# EAGLE design Inverter (EAGLE 7.3.0)
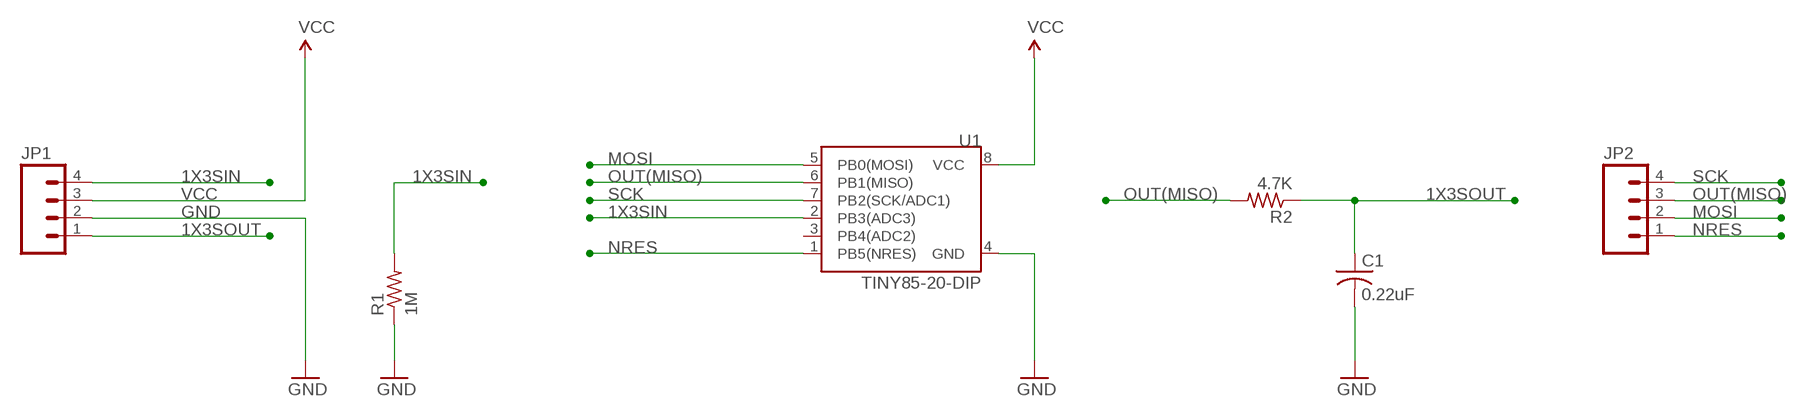
[diagram p0: schematic, sheet 1]

## Parts
C1  0.22uF  C-USC0603  [C0603]
JP1  M04PTH  [1X04]
JP2  M04PTH  [1X04]
R1  1M  R-US_R0603  [R0603]
R2  4.7K  R-US_R0603  [R0603]
U1  TINY85-20-DIP  ATTINY45TINY85-20-DIP  [DIP08]

## Nets
1X3SIN: JP1.4 R1.2 U1.2(PB3(ADC3))
1X3SOUT: C1.1 JP1.1 R2.1
GND: C1.2 JP1.2 R1.1 U1.4(GND)
MOSI: JP2.2 U1.5(PB0(MOSI))
NRES: JP2.1 U1.1(PB5(NRES))
OUT(MISO): JP2.3 R2.2 U1.6(PB1(MISO))
SCK: JP2.4 U1.7(PB2(SCK/ADC1))
VCC: JP1.3 U1.8(VCC)
Unconnected: U1.3(PB4(ADC2))

## Library data of the parts
C1 = adafruit:C-US: CAPACITOR, American symbol
JP1 JP2 = SparkFun-Connectors:M04: Header 4 Standard 4-pin 0.1" header. Use with straight break away headers (SKU : PRT-00116), right angle break away headers (PRT-00553), swiss pins (PRT-00743), machine pins (PRT-00117), and female headers (PRT-00115). Molex polarized connector foot print use with SKU : PRT-08231 with associated crimp pins and housings. 1MM SMD Version SKU: PRT-10208
R1 R2 = adafruit:R-US_: RESISTOR, American symbol
U1 = SparkFun-DigitalIC:ATTINY45: Atmel 8-pin 2/4/8kB flash uC; PROD_ID: IC-09445

## Board
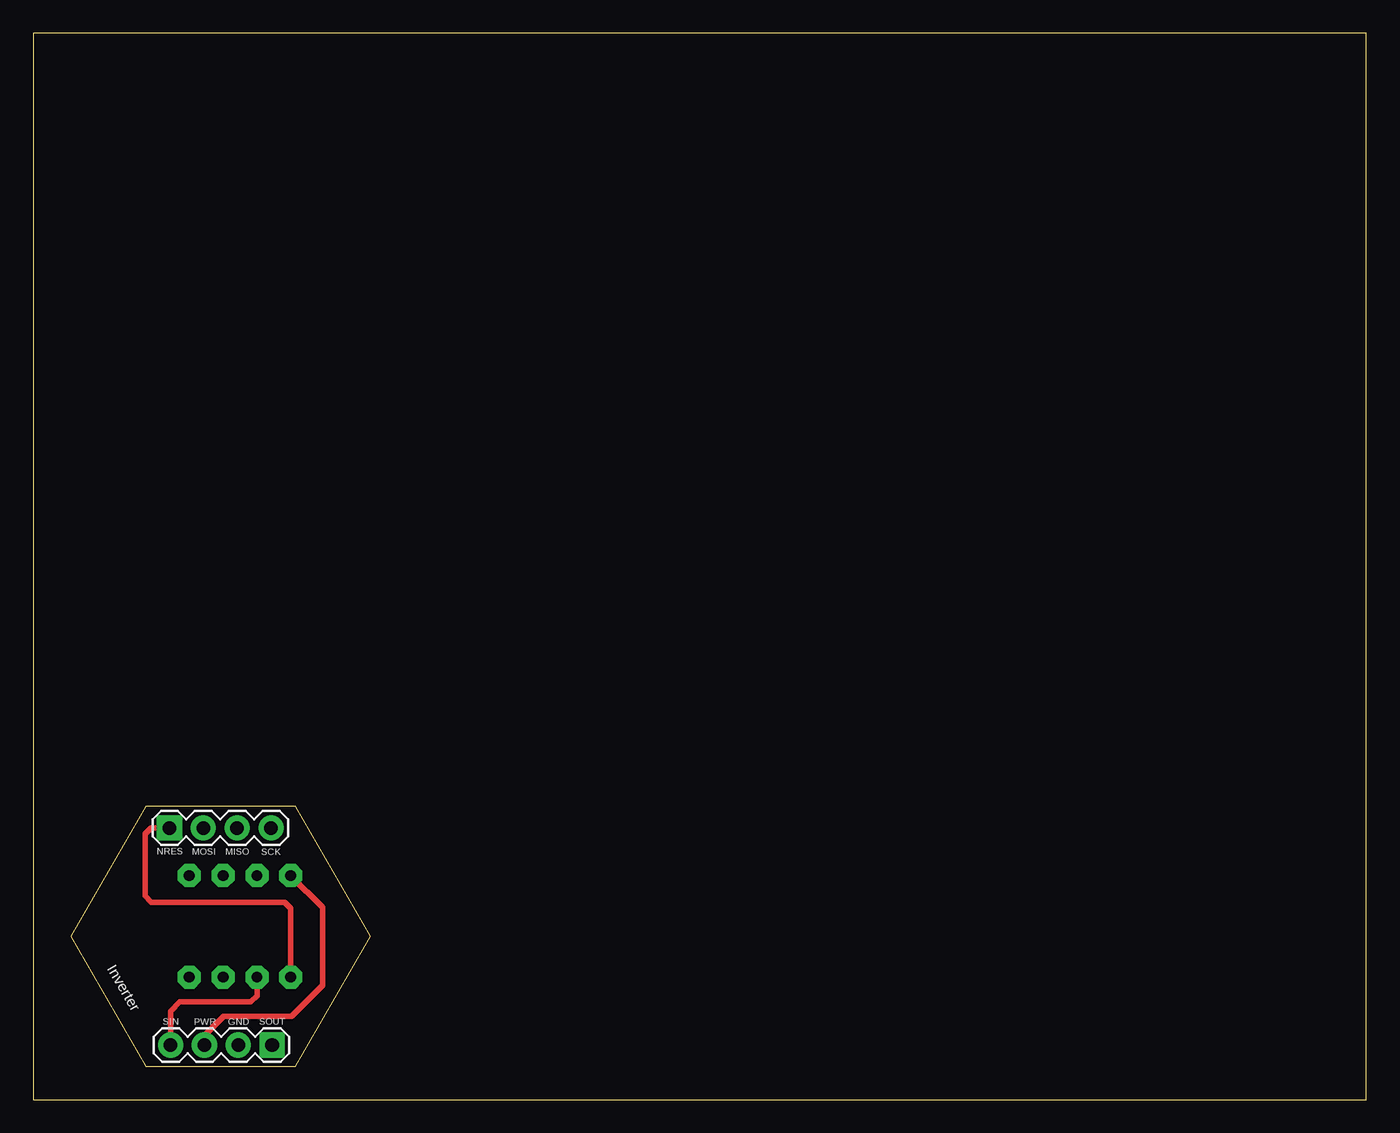
[diagram p1: board, top side]
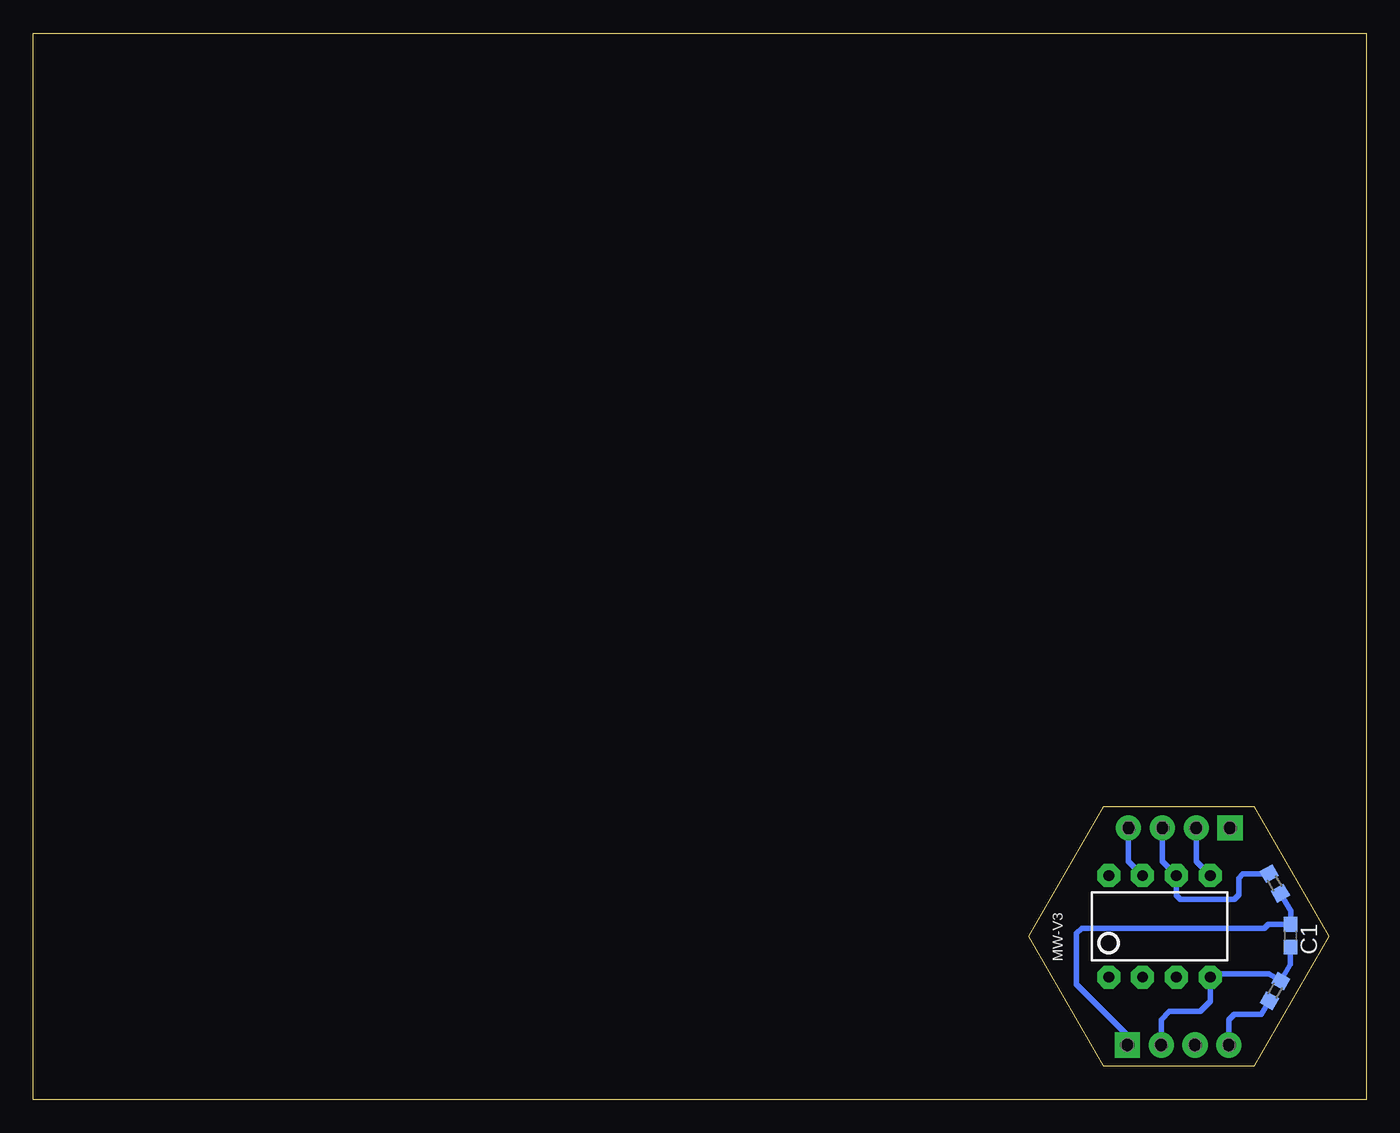
[diagram p2: board, bottom side, seen from below]

Size 100 x 80 mm. Coordinates in mm from the lower left corner, seen from the top.
Outline: 0,0 100,0 100,80 0,80 0,0
Outline: 8.45,2.5 19.7,2.5 25.32,12.24 19.7,21.98 8.45,21.98 2.82,12.24 8.45,2.5
Copper layers (1*16): Top 0.035mm / dielectric 1.5mm / Bottom 0.035mm
Design rules "default": minimum track width 10mil, minimum drill 24mil, track to track 8mil, track to pad 8mil, pad to pad 8mil, via to via 8mil, smd to smd 8mil, copper to edge 40mil, drill to drill 8mil, minimum pad ring 10mil, minimum via ring 8mil, stop-mask expansion 4mil, vias tented up to drill 0mil, thermal gap 10mil

### Footprints (pad centres in the part's own frame; a part is rotated, then mirrored left to right if it is on the bottom)
C0603 = smd 1.1 x 1: 1 -0.85,0; 2 0.85,0
1X04 = drill 1.016 pad 1.88 square: 1 0,0 | drill 1.016 pad 1.88: 2 2.54,0; 3 5.08,0; 4 7.62,0
R0603 = smd 1 x 1.1: 1 -0.85,0; 2 0.85,0
DIP08 = drill 0.813 pad 1.727 octagon: 1 -3.81,-3.81; 2 -1.27,-3.81; 3 1.27,-3.81; 4 3.81,-3.81; 5 3.81,3.81; 6 1.27,3.81; 7 -1.27,3.81; 8 -3.81,3.81

### Placement (x,y rotation side)
C1  5.68,12.29 270 bottom
JP1  17.92,4.09 180 top
JP2  10.21,20.37 0 top
R1  6.83,8.15 240 bottom
R2  6.86,16.22 120 bottom
U1  15.51,12.99 0 bottom

### Tracks (layer width: path | path; a pad name or v marks a point on that pad's centre or on a via)
1X3SIN
  Top 0.4: U1.2 16.78,7.8 16.31,7.33 11,7.33 10.3,6.63 JP1.4
  Bottom 0.4: R1.2 7.87,6.38 9.91,6.38 10.3,5.98 JP1.4
1X3SOUT
  Bottom 0.4: R2.1 5.66,14.16 | JP1.1 17.92,4.83 21.73,8.64 21.73,12.47 21.35,12.86
  Bottom 0.406: 5.66,14.16 5.66,13.16 C1.1 7.35,13.14 7.64,12.86 21.35,12.86
GND
  Bottom 0.4: 5.68,10.16 R1.1 7.29,9.42 11.46,9.42 U1.4 11.7,7.35 12.45,6.6 14.76,6.6 15.37,5.99 15.37,4.1 JP1.2
  Bottom 0.406: C1.2 5.68,10.16
MOSI
  Bottom 0.4: JP2.2 12.75,17.86 U1.5
NRES
  Top 0.4: JP2.1 8.85,20.37 8.39,19.91 8.39,15.27 8.85,14.81 18.85,14.81 19.32,14.34 U1.1
OUT(MISO)
  Bottom 0.4: JP2.3 15.29,17.86 U1.6 14.24,15.33 13.93,15.02 9.91,15.02 9.56,15.37 9.56,16.61 9.26,16.92 7.32,16.92 R2.2
SCK
  Bottom 0.4: JP2.4 17.83,17.86 U1.7
VCC
  Top 0.4: U1.8 21.7,14.4 21.7,8.59 19.37,6.25 14.28,6.25 12.84,4.81 JP1.3

### Text on the board
tPlace: NRES | MOSI | MISO | SCK | Inverter | SIN | PWR | GND | SOUT
bPlace: MW-V3